# Altium schematic sheet Connectors.SchDoc
size A; SheetNumber: 5; SheetTotal: 5
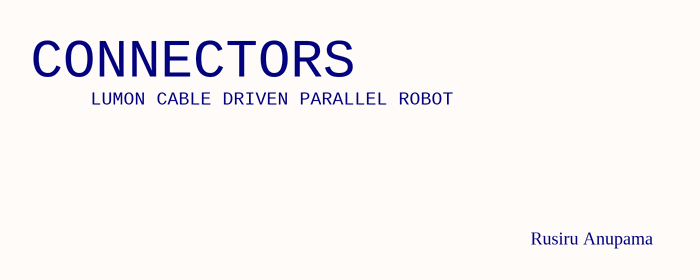
[diagram p0: Connectors.SchDoc]

## Notes on the sheet
- CONNECTORS
- LUMON CABLE DRIVEN PARALLEL ROBOT
- Rusiru Anupama